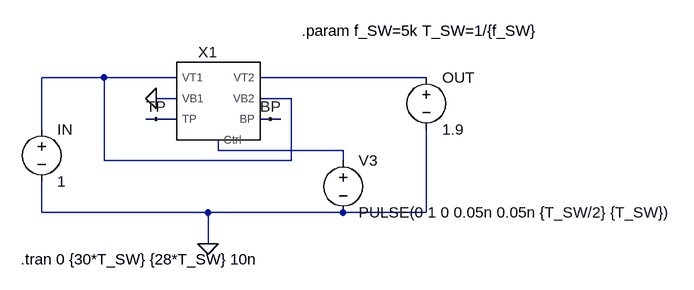
[diagram p0: schematic PTM_tb.asc]
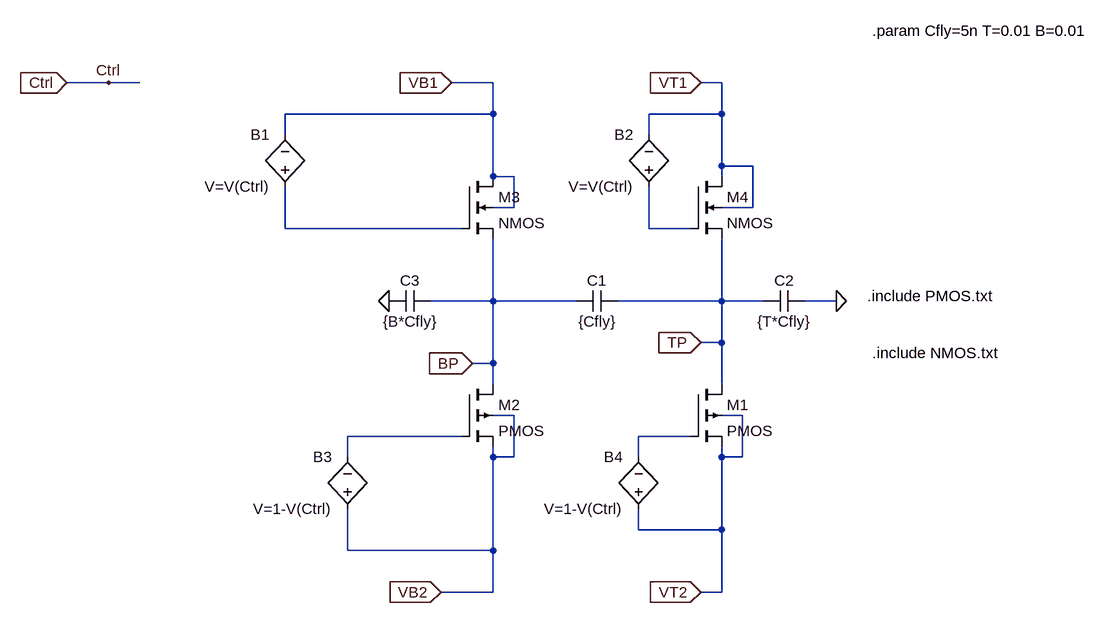
[diagram p1: sub-circuit sccore_ptm.asc]
PTM_tb.asc, the LTspice schematic file:
Version 4
SHEET 1 940 680
WIRE 16 112 -80 112
WIRE 128 112 16 112
WIRE 512 112 256 112
WIRE 128 144 96 144
WIRE 304 144 256 144
WIRE 96 176 80 176
WIRE 128 176 96 176
WIRE 272 176 256 176
WIRE 288 176 272 176
WIRE -80 192 -80 112
WIRE 192 224 192 208
WIRE 384 224 192 224
WIRE 16 240 16 112
WIRE 304 240 304 144
WIRE 304 240 16 240
WIRE 384 240 384 224
WIRE -80 320 -80 272
WIRE 176 320 -80 320
WIRE 384 320 176 320
WIRE 512 320 512 192
WIRE 512 320 384 320
WIRE 176 368 176 320
FLAG 176 368 0
FLAG 96 144 0
FLAG 272 176 BP
FLAG 96 176 TP
SYMBOL SCcore_PTM 176 176 R0
SYMATTR InstName X1
SYMATTR SpiceLine CFly=45n, T=0.01 B =0.01
SYMBOL voltage -80 176 R0
WINDOW 123 0 0 Left 0
WINDOW 39 0 0 Left 0
SYMATTR InstName IN
SYMATTR Value 1
SYMBOL voltage 512 96 R0
WINDOW 123 0 0 Left 0
WINDOW 39 0 0 Left 0
SYMATTR InstName OUT
SYMATTR Value 1.9
SYMBOL voltage 384 224 R0
WINDOW 123 0 0 Left 0
WINDOW 39 0 0 Left 0
SYMATTR InstName V3
SYMATTR Value PULSE(0 1 0 0.05n 0.05n {T_SW/2} {T_SW})
TEXT 320 40 Left 2 !.param f_SW=5k T_SW=1/{f_SW}
TEXT -112 392 Left 2 !.tran 0 {30*T_SW} {28*T_SW} 10n

sccore_ptm.asc, the sub-circuit schematic file:
Version 4
SHEET 1 888 680
WIRE -656 -304 -720 -304
WIRE -608 -304 -656 -304
WIRE -64 -304 -128 -304
WIRE 288 -304 256 -304
WIRE -64 -256 -64 -304
WIRE -64 -256 -384 -256
WIRE 288 -256 288 -304
WIRE 288 -256 176 -256
WIRE -384 -224 -384 -256
WIRE 176 -224 176 -256
WIRE 288 -176 288 -256
WIRE 336 -176 288 -176
WIRE -64 -160 -64 -256
WIRE -32 -160 -64 -160
WIRE 288 -160 288 -176
WIRE -32 -112 -32 -160
WIRE -32 -112 -64 -112
WIRE 336 -112 336 -176
WIRE 336 -112 288 -112
WIRE -384 -80 -384 -144
WIRE -112 -80 -384 -80
WIRE 176 -80 176 -144
WIRE 240 -80 176 -80
WIRE -64 32 -64 -64
WIRE -64 32 -160 32
WIRE 64 32 -64 32
WIRE 288 32 288 -64
WIRE 288 32 128 32
WIRE 352 32 288 32
WIRE 464 32 416 32
WIRE 288 96 288 32
WIRE 288 96 256 96
WIRE -64 128 -64 32
WIRE -64 128 -96 128
WIRE -64 160 -64 128
WIRE 288 160 288 96
WIRE -32 208 -64 208
WIRE 320 208 288 208
WIRE -112 240 -288 240
WIRE 240 240 160 240
WIRE -288 272 -288 240
WIRE -64 272 -64 256
WIRE -32 272 -32 208
WIRE -32 272 -64 272
WIRE 160 272 160 240
WIRE 288 272 288 256
WIRE 320 272 320 208
WIRE 320 272 288 272
WIRE 160 384 160 352
WIRE 288 384 288 272
WIRE 288 384 160 384
WIRE -288 416 -288 352
WIRE -64 416 -64 272
WIRE -64 416 -288 416
WIRE -64 480 -64 416
WIRE -64 480 -144 480
WIRE 288 480 288 384
WIRE 288 480 256 480
FLAG -128 -304 VB1
IOPIN -128 -304 In
FLAG 256 -304 VT1
IOPIN 256 -304 In
FLAG -144 480 VB2
IOPIN -144 480 In
FLAG 256 480 VT2
IOPIN 256 480 In
FLAG -720 -304 Ctrl
IOPIN -720 -304 In
FLAG 464 32 0
FLAG -224 32 0
FLAG -656 -304 Ctrl
FLAG 256 96 TP
IOPIN 256 96 In
FLAG -96 128 BP
IOPIN -96 128 In
SYMBOL pmos4 240 160 R0
SYMATTR InstName M1
SYMATTR Value2 w=531u
SYMBOL pmos4 -112 160 R0
SYMATTR InstName M2
SYMATTR Value2 w=531u
SYMBOL nmos4 -112 -160 R0
SYMATTR InstName M3
SYMATTR Value2 w=100u
SYMBOL nmos4 240 -160 R0
SYMATTR InstName M4
SYMATTR Value2 w=100u
SYMBOL cap 128 16 R90
WINDOW 0 0 32 VBottom 2
WINDOW 3 32 32 VTop 2
SYMATTR InstName C1
SYMATTR Value {Cfly}
SYMBOL bv -384 -128 R180
WINDOW 0 24 96 Left 2
WINDOW 3 24 16 Left 2
SYMATTR InstName B1
SYMATTR Value V=V(Ctrl)
SYMBOL bv 176 -128 R180
WINDOW 0 24 96 Left 2
WINDOW 3 24 16 Left 2
SYMATTR InstName B2
SYMATTR Value V=V(Ctrl)
SYMBOL cap 416 16 R90
WINDOW 0 0 32 VBottom 2
WINDOW 3 32 32 VTop 2
SYMATTR InstName C2
SYMATTR Value {T*Cfly}
SYMBOL cap -160 16 R90
WINDOW 0 0 32 VBottom 2
WINDOW 3 32 32 VTop 2
SYMATTR InstName C3
SYMATTR Value {B*Cfly}
SYMBOL bv -288 368 R180
WINDOW 0 24 96 Left 2
WINDOW 3 24 16 Left 2
SYMATTR InstName B3
SYMATTR Value V=1-V(Ctrl)
SYMBOL bv 160 368 R180
WINDOW 0 24 96 Left 2
WINDOW 3 24 16 Left 2
SYMATTR InstName B4
SYMATTR Value V=1-V(Ctrl)
TEXT 512 24 Left 2 !.include PMOS.txt
TEXT 520 -384 Left 2 !.param Cfly=5n T=0.01 B=0.01
TEXT 520 112 Left 2 !.include NMOS.txt

The netlist it stands for:
* PTM_tb.asc
XX1 N003 0 N001 N001 N002 TP BP sccore_ptm params: CFly=45n, T=0.01 B =0.01
V§IN N001 0 1
V§OUT N002 0 1.9
V3 N003 0 PULSE(0 1 0 0.05n 0.05n {T_SW/2} {T_SW})

* block symbol definitions
.subckt sccore_ptm Ctrl VB1 VB2 VT1 VT2 TP BP
M1 TP N004 VT2 VT2 PMOS w=531u
M2 BP N003 VB2 VB2 PMOS w=531u
M3 VB1 N001 BP VB1 NMOS w=100u
M4 VT1 N002 TP VT1 NMOS w=100u
C1 TP BP {Cfly}
B1 N001 VB1 V=V(Ctrl)
B2 N002 VT1 V=V(Ctrl)
C2 0 TP {T*Cfly}
C3 BP 0 {B*Cfly}
B3 VB2 N003 V=1-V(Ctrl)
B4 VT2 N004 V=1-V(Ctrl)
.include PMOS.txt
.param Cfly=5n T=0.01 B=0.01
.include NMOS.txt
.ends sccore_ptm

.model NMOS NMOS
.model PMOS PMOS
.lib standard.mos
.param f_SW=5k T_SW=1/{f_SW}
.tran 0 {30*T_SW} {28*T_SW} 10n
.backanno
.end